# Altium schematic sheet dAir-usb-plug-in-compatible.SchDoc
size A3
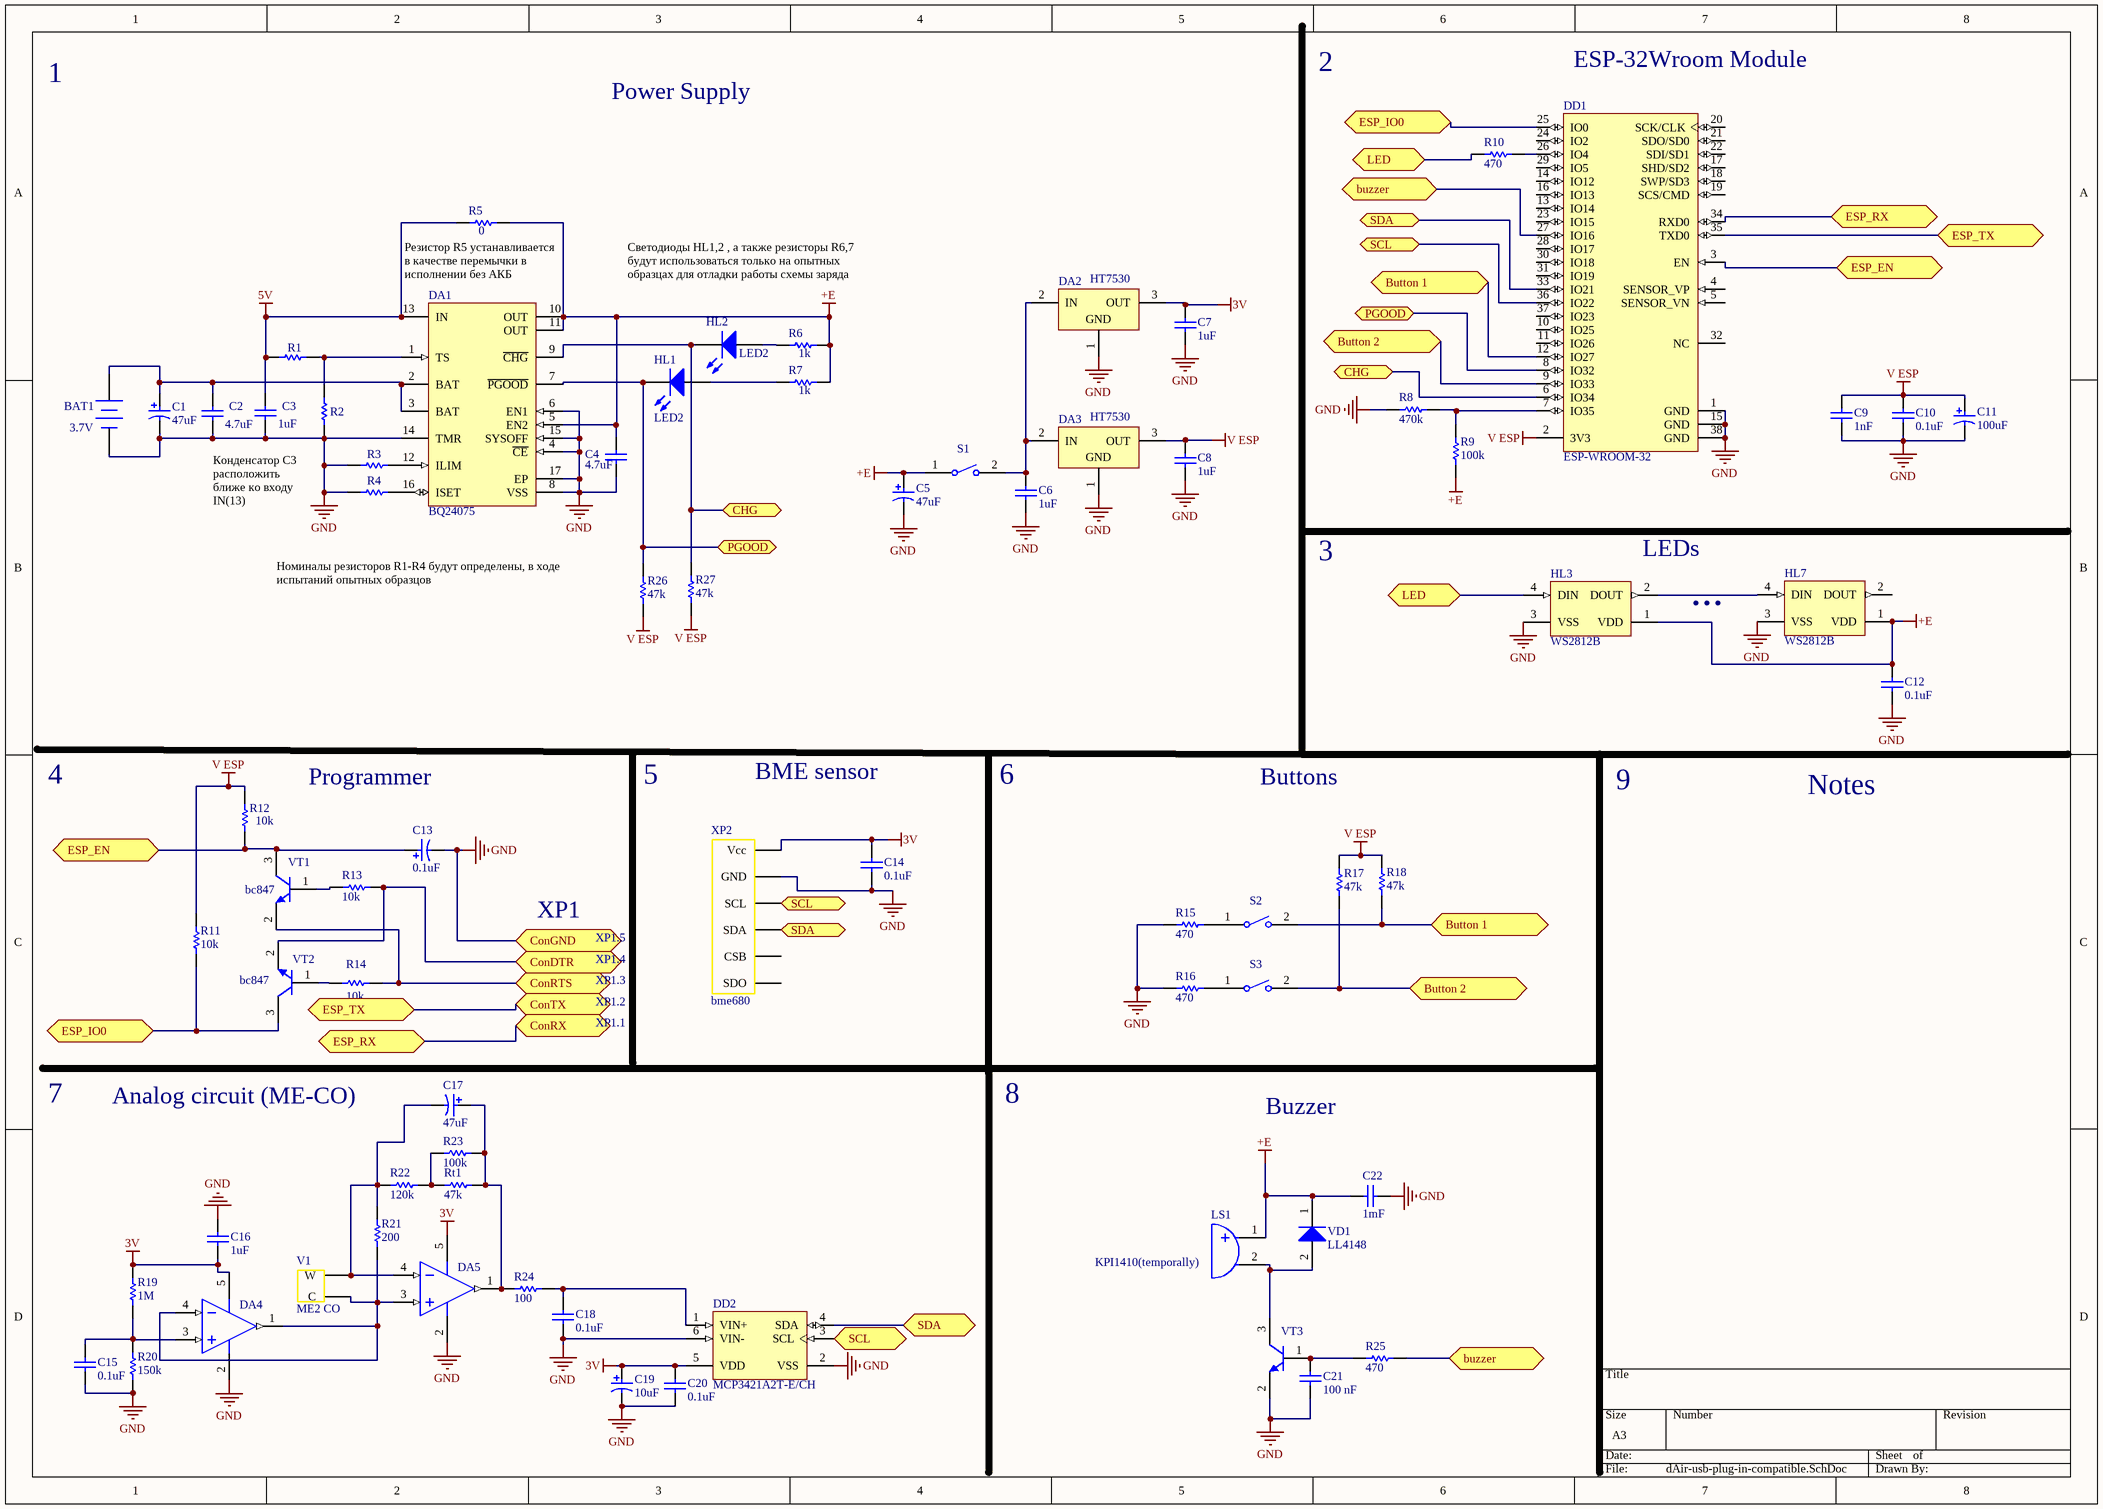
[diagram p0: dAir-usb-plug-in-compatible.SchDoc]

## Parts
BAT1  3.7V  [PANA-CR-2032HFN]
C1  47uF  [KEMT-A-3216-18-2_M]
C2  4.7uF  [CAPC0805(2012)155_L]
C3  1uF  [CAPC0805(2012)155_L]
C4  4.7uF  [CAPC0805(2012)155_L]
C5  47uF  [KEMT-A-3216-18-2_M]
C6  1uF  [CAPC0805(2012)155_L]
C7  1uF  [CAPC0805(2012)155_L]
C8  1uF  [CAPC0805(2012)155_L]
C9  1nF  [CAPC0805(2012)155_L]
C10  0.1uF  [CAPC0805(2012)155_L]
C11  100uF  [KEMT-A-3216-18-2_M]
C12  0.1uF  [CAPC0805(2012)155_L]
C13  0.1uF  [KEMT-A-3216-18-2_M]
C14  0.1uF  [CAPC0805(2012)155_L]
C15  0.1uF  [CAPC0805(2012)155_L]
C16  1uF  [CAPC0805(2012)155_L]
C17  47uF  [KEMT-A-3216-18-2_M]
C18  0.1uF  [CAPC0805(2012)155_L]
C19  10uF  [KEMT-A-3216-18-2_M]
C20  0.1uF  [CAPC0805(2012)155_L]
C21  100 nF  [CAPC0805(2012)155_L]
C22  1mF  [CAPC0805(2012)155_L]
DA1  BQ24075  [RGT0016C_V]
DA2  HT7530  [SOT89_N]
DA3  HT7530  [SOT89_N]
DA4  AD8603AUJ-REEL  [ADI-UJ-5_M]  (value not drawn)
DA5  AD8603AUJ-REEL  [ADI-UJ-5_M]  (value not drawn)
DD1  ESP-WROOM-32  [OLMX-ESP-WROOM-32]
DD2  MCP3421A2T-E/CH  [SOT-23-CH6_L]
HL1  LED2  [3.2X1.6X1.1]
HL2  LED2  [3.2X1.6X1.1]
HL3  WS2812B  [ADAI-WS2812B_V]
HL7  WS2812B  [ADAI-WS2812B_V]
LS1  KPI1410(temporally)  [CZCY-CY-12085G-5042-2_V]
R1  1k  [RESC0805(2012)_M]  (value not drawn)
R2  1k  [RESC0805(2012)_M]  (value not drawn)
R3  1k  [RESC0805(2012)_M]  (value not drawn)
R4  1k  [RESC0805(2012)_M]  (value not drawn)
R5  0  [RESC0805(2012)_M]
R6  1k  [RESC0805(2012)_M]
R7  1k  [RESC0805(2012)_M]
R8  470k  [RESC0805(2012)_M]
R9  100k  [RESC0805(2012)_M]
R10  470  [RESC0805(2012)_M]
R11  10k  [RESC0805(2012)_M]
R12  10k  [RESC0805(2012)_M]
R13  10k  [RESC0805(2012)_M]
R14  10k  [RESC0805(2012)_M]
R15  470  [RESC0805(2012)_M]
R16  470  [RESC0805(2012)_M]
R17  47k  [RESC0805(2012)_M]
R18  47k  [RESC0805(2012)_M]
R19  1M  [RESC0805(2012)_M]
R20  150k  [RESC0805(2012)_M]
R21  200  [RESC0805(2012)_M]
R22  120k  [RESC0805(2012)_M]
R23  100k  [RESC0805(2012)_M]
R24  100  [RESC0805(2012)_M]
R25  470  [RESC0805(2012)_M]
R26  47k  [RESC0805(2012)_M]
R27  47k  [RESC0805(2012)_M]
Rt1  47k  [RESC0805(2012)_M]
S1  FSMSMTR  [TECO-FSMSMTR_V]  (value not drawn)
S2  FSMSMTR  [TECO-FSMSMTR_V]  (value not drawn)
S3  FSMSMTR  [TECO-FSMSMTR_V]  (value not drawn)
V1  ME2 CO  [ME2 CO]
VD1  LL4148  [INF-SOD323_V]
VT1  bc847  [ONSC-SOT-23-3-318-08_V]
VT2  bc847  [ONSC-SOT-23-3-318-08_V]
VT3  (no value)  [ONSC-SOT-23-3-318-08_V]
XP2  bme680  [BME280]

## Ports
Button 1 (bidir), Button 2 (bidir), buzzer (bidir), CHG (bidir), ConDTR (bidir), ConGND (bidir), ConRTS (bidir), ConRX (bidir), ConTX (bidir), ESP_EN (bidir), ESP_IO0 (bidir), ESP_RX (bidir), ESP_TX (bidir), LED (bidir), PGOOD (bidir), SCL (bidir), SDA, SDA (bidir)

## Nets
3V: C7.2 C14.2 C16.1 C19.1 C20.2 DA2.3(OUT) DA4.5(+V) DA5.5(+V) DD2.5(VDD) R19.2 XP2.1(Vcc)
5V: C3.1 DA1.13(IN) R1.1 R5.2
+E: C4.1 C5.1 C12.2 C22.1 DA1.5(EN2) DA1.10(OUT) DA1.11(OUT) HL3.1(VDD) HL7.1(VDD) LS1.1(A) R5.1 R6.1 R7.1 R9.2 S1.1 VD1.1(K)
GND: BAT1.2(-) C1.2 C2.2 C3.2 C4.2 C5.2 C6.1 C7.1 C8.1 C9.1 C10.1 C11.2 C12.1 C13.2 C14.1 C15.1 C16.2 C18.2 C19.2 C20.1 C21.2 C22.2 DA1.4(~{CE}) DA1.6(EN1) DA1.8(VSS) DA1.14(TMR) DA1.15(SYSOFF) DA1.17(EP) DA2.1(GND) DA3.1(GND) DA4.2(-V) DA5.2(-V) DD1.1(GND) DD1.15(GND) DD1.38(GND) DD2.2(VSS) DD2.6(VIN-) HL3.3(VSS) HL7.3(VSS) R2.2 R3.2 R4.2 R8.1 R15.1 R16.1 R20.1 VT3.2(E) XP2.2(GND) ; port ConGND
V ESP: C8.2 C9.2 C10.2 C11.1 DA3.3(OUT) DD1.2(3V3) R11.2 R12.2 R17.2 R18.2 R26.1 R27.1
Button 1: DD1.12(IO27) R18.1 S2.2 ; port Button 1
Button 2: DD1.9(IO33) R17.1 S3.2 ; port Button 2
buzzer: DD1.27(IO16) R25.2 ; port buzzer
CHG: DA1.9(~{CHG}) DD1.6(IO34) HL2.2(K) R27.2 ; port CHG
ConDTR: R13.2 VT2.2(E) ; port ConDTR
ConRTS: R14.2 VT1.2(E) ; port ConRTS
ConRX: DD1.34(RXD0) ; port ConRX, port ESP_RX
ConTX: DD1.35(TXD0) ; port ConTX, port ESP_TX
ESP_EN: C13.1 DD1.3(EN) R12.1 VT1.3(C) ; port ESP_EN
ESP_IO0: DD1.25(IO0) R11.1 VT2.3(C) ; port ESP_IO0
LED: HL3.4(DIN) R10.1 ; port LED
PGOOD: DA1.7(~{PGOOD}) DD1.8(IO32) HL1.2(K) R26.2 ; port PGOOD
SCL: DD1.36(IO22) DD2.3(SCL) XP2.3(SCL) ; port SCL
SDA: DD1.33(IO21) DD2.4(SDA) XP2.4(SDA) ; port SDA
NetBAT1_1: BAT1.1(+) C1.1 C2.1 DA1.2(BAT) DA1.3(BAT)
NetC6_2: C6.2 DA2.2(IN) DA3.2(IN) S1.2
NetC15_2: C15.2 DA4.3(+IN) R19.1 R20.2
NetC17_1: C17.1 DA5.1(OUT) R23.2 R24.1 Rt1.2
NetC17_2: C17.2 DA5.4(-IN) R21.2 R22.1 V1.1(W)
NetC18_1: C18.1 DD2.1(VIN+) R24.2
NetC21_1: C21.1 R25.1 VT3.1(B)
NetDA1_1: DA1.1(TS) R1.2 R2.1
NetDA1_12: DA1.12(ILIM) R3.1
NetDA1_16: DA1.16(ISET) R4.1
NetDA4_1: DA4.1(OUT) DA4.4(-IN) DA5.3(+IN) R21.1 V1.2(C)
NetDD1_7: DD1.7(IO35) R8.2 R9.1
NetDD1_26: DD1.26(IO4) R10.2
NetHL1_1: HL1.1(A) R7.2
NetHL2_1: HL2.1(A) R6.2
NetHL3_2: HL3.2(DOUT) HL7.4(DIN)
NetLS1_2: LS1.2(K) VD1.2(A) VT3.3(C)
NetR13_1: R13.1 VT1.1(B)
NetR14_1: R14.1 VT2.1(B)
NetR15_2: R15.2 S2.1
NetR16_2: R16.2 S3.1
NetR22_2: R22.2 R23.1 Rt1.1

Not connected (* = marked no-connect by the designer): DD1 4(SENSOR_VP) 5(SENSOR_VN) 10(IO25) 11(IO26) 13(IO14) 14(IO12) 16(IO13) 17(SHD/SD2) 18(SWP/SD3) 19(SCS/CMD) 20(SCK/CLK) 21(SDO/SD0) 22(SDI/SD1) 23(IO15) 24(IO2) 28(IO17) 29(IO5) 30(IO18) 31(IO19) 32(NC) 37(IO23); HL7 2(DOUT); XP2 5(CSB) 6(SDO)

## Notes on the sheet
- 1
- Power Supply
- 2
- (near DD1) ESP-32Wroom Module
- (near R5) Резистор R5 устанавливается в качестве перемычки в исполнении без АКБ
- Светодиоды HL1,2 , а также резисторы R6,7 будут использоваться только на опытных образцах для отладки работы схемы заряда
- Конденсатор C3 расположить ближе ко входу IN(13)
- 3
- (near HL3) LEDs
- Номиналы резисторов R1-R4 будут определены, в ходе испытаний опытных образцов
- (near HL7) ...
- 4
- Programmer
- 5
- BME sensor
- 6
- Buttons
- 9
- Notes
- XP1
- XP1.3
- XP1.4
- XP1.5
- XP1.1
- XP1.2
- 7
- Analog circuit (ME-CO)
- 8
- Buzzer

## Library data of the parts
BAT1 = CMP-2000-05296-1: Coin Cell Battery, 225 mAh, 0.2 mA, 3 V, -30 to 60 degC, Bulk; Manufacturer: Panasonic; SVHC: 1,2-dimethoxyethane,ethyleneglycoldimethylether(EGDME)(15-Jun-2015); Battery Size Code: 2032; Battery Voltage: 3V; Battery IEC Code: CR2032; Battery NEDA Code: 5004LC; External Height: 3.2mm; Battery Terminals: PCBPins; Battery Capacity: 220mAh; External Diameter: 20mm; Battery Technology: LithiumManganeseDioxide; Product Range: -; Datasheet Version: Rev. 0, 05/2010; Manufacturer URL: http://www.panasonic.com/; External Depth: -; Weight: 2.9g; Datasheet URL: https://datasheet.ciiva.com/3/aaa4000de87-3072.pdf; External Width: -
C1 C5 C11 C13 C17 C19 = CMP-2000-05172-1: Manufacturer Size Code: A; Manufacturer: Kemet; Type: Molded; Online Catalog: T491Series; Other Names: 399-3684-2; Voltage - Rated: 10V; Lifetime @ Temp.: 2000Hrs@85degC; Product Training Modules: CapacitorBasics-TypicalUsesforCapacitorsDeratingGuidelinesforSurfaceMountTantalumCapacitors; ESR (Equivalent Series Resistance): 3.8Ohm; Tolerance: ±10%; Capacitance: 10µF; Catalog Drawings: T49x,T5xxSeries_A-side1T49x,T5xxSeries_A,B-side2T49x,T5xxSeries_A,SBottom; Family: TantalumCapacitors; Manufacturer URL: http://www.kemet.com/; Datasheet URL: http://www.farnell.com/datasheets/1824869.pdf; Package Reference: 1206; Packaging: Tape&Reel(TR); Series: T491; Operating Temperature: -55degC~125degC; Mounting Type: SurfaceMount; Height - Seated (Max): 0.071"(1.80mm); Package / Case: 1206(3216Metric); Package Description: 2-Pin Surface Mount Device, Body 3.2 x 1.6 mm; Features: GeneralPurpose; Lead Spacing: -; Size / Dimension: 0.126"Lx0.063"W(3.20mmx1.60mm); Standard Package: 2,000; Datasheet Version: Apr-14; Category: Capacitors
C2-C4 C6-C10 C12 C14-C16 C18 C20 = CMP-1036-04882-1: CAP 4.7uF 10V ±10% 0805 (2012 Metric) Thickness 1.55mm SMD; Case-EIA: 0805; Tolerance: Â±10%; Case-Metric: 2012; Rated Voltage: 10 V; Max Thickness: 1.55 mm; Technology: SMT; Value: 4.7uF
C21 C22 = CMP-1036-04882-1: CAP 4.7uF 10V ±10% 0805 (2012  Thickness 1.55mm SMD; Case-EIA: 0805; Tolerance: Â±10%; Case-Metric: 2012; Rated Voltage: 10 V; Max Thickness: 1.55 mm; Technology: SMT; Value: 4.7uF
DA1 = CMP-0321-00238-2: USB-Friendly Li-Ion Battery Charger and Power-Path Management IC, Vout 5.5 V, 4.3 V, -40 to 85 degC, 16-pin QFN (RGT), Green (RoHS & no Sb/Br); PartNumber: BQ24075RGTR; Manufacturer: Texas Instruments; SubFamily: Battery Charge Management; NiCd: N; Vin(Min)(V): 4.3; Mounting Technology: Surface Mount; PackageDescription: 16-Pin Plastic Quad Flat No-Lead, 3 x 3 mm Body, 0.5 mm Pitch, 1.7 x 1.7 mm Exposed Pad; Over Voltage Protection: N; Code_JEDEC: MO-220; Li-Ion: N; Eco-Plan: Green (RoHS & no Sb/Br); DatasheetVersion: SLUS810G; PackageVersion: revH, Oct-2011; PackageReference: RGT0016C; ComponentLink1URL: http://www.ti.com/general/docs/lit/getliterature.tsp?genericPartNumber=BQ24075&fileType=pdf; Lead Acid: N; ComponentLink1Description: Datasheet; Li-Polymer: N; NiMH: N
DA2 DA3 = CMP-0204-00106-1: 100mA Low Power LDO, Output Voltage 3.0V, SOT89 Pkg; DatasheetVersion: Rev1.80, Mar-2010; PackageDescription: 3-Pin SOT-89 Package 1.5 mm Pitch, 4.1 mm Lead Span; PackageReference: SOT89; PackageVersion: May-2010; Code_IPC: SOT89
DA4 DA5 = CMP-0384-02070-2: Single Channel Single-Supply Operation Operational Amplifier, 400 KHz BW, 100 mV/us SR, Industrial, 5-pin SOT23 (UJ-5), Reel; Manufacturer: Analog Devices; Generic Part Number: AD8603; Iq/Amp: 50uA; Input Bias Current: 200fA; V Span Min: 1.8V; Small Signal Bandwidth: 400KHz; Input Offset Voltage: 12uV; V Span Max: 6V; Amplifiers Per Package: 1; ComponentLink2Description: Datasheet; RevisionNote: Reference Circuit URL fixed; ComponentLink3URL: http:/www.analog.com/static/imported-files/packages/PKG_PDF/TSOT(UJ)/UJ_5.pdf; ComponentLink1URL: http://www.analog.com/en/index.html; Mounting Technology: Surface Mount; ComponentLink1Description: Manufacturer URL; PackageReference: UJ-5; ComponentLink4Description: Reference Circuit; DatasheetVersion: Rev. C; ComponentLink3Description: Package Specification; PartNumber: AD8603AUJ-REEL; PackageVersion: 100708-A; ComponentLink2URL: http://www.analog.com/static/imported-files/data_sheets/AD8603_8607_8609.pdf; PackageDescription: 5-Pin Thin Small Outline Transistor Package, Body 2.9 x 1.6 mm, Pitch 0.95 mm; ComponentLink4URL: http://www.analog.com/en/all-operational-amplifiers-op-amps/operational-amplifiers-op-amps/ad8603/products/product.html#product-recommendations; Code_JEDEC: MO-193-AB; Slew Rate: 100mV/us
DD1 = CMP-2000-07454-1: Espressif System, 2.7 to 3.6 V, -40 to 85 degC, 38-Pin SMD; Manufacturer: Olimex; Package Description: 38-Pin Surface Mount Device, Body 18 x 25.5 mm, Pitch 1.27 mm; Manufacturer URL: https://www.olimex.com; RoHSCompliant: false; Mounting Technology: SurfaceMount; Datasheet Version: Rev. 2.1, 09/2017; Datasheet URL: http://www.espressif.com/sites/default/files/documentation/esp-wroom-32_datasheet_en.pdf; Package Reference: ESP-WROOM-32
DD2 = CMP-0188-00097-2: 18-Bit Analog-to-Digital Converter with I2C Interface and On-Board Reference, 6-Pin SOT-23, Extended Temperature, Tape and Reel; ComponentLink3URL: http://www.microchip.com/stellent/groups/techpub_sg/documents/packagingspec/en012702.pdf; DatasheetVersion: revE, Aug-2009; Code_IPC: SOT26A-6; RevisionNote: URLs added.; ComponentLink2URL: http://ww1.microchip.com/downloads/en/DeviceDoc/22003e.pdf; ComponentLink1URL: http://www.microchip.com/; ComponentLink3Description: Package Specification; ComponentLink2Description: Datasheet; PackageReference: SOT-23-CH6; PackageDescription: 6-Lead Plastic Small Outline Transistor (CH) [SOT-23]; PackageVersion: revBB, Aug-2009; ComponentLink1Description: Manufacturer URL
HL1 HL2 = LED2: Typical RED, GREEN, YELLOW, AMBER GaAs LED; Published: 8-Jun-2000; LatestRevisionDate: 17-Jul-2002; LatestRevisionNote: Re-released for DXP Platform.; PackageVersion: Feb-2002; PackageReference: 3.2X1.6X1.1; Publisher: Altium Limited; PackageDescription: SM LED; 2 Flat Leads
HL3 HL7 = CMP-1740-00005-1: Intelligent Control LED Integrated Light Source, 3.5 to 5.3 V, -25 to 80 degC, 4-Pin SMD, RoHS, Bulk; Case\Package: Radial; Shielding: Unshielded; Current Rating: 240 mA; Tolerance: 10%; Mount: Through Hole; Max Operating Temperature: 125 degC; Radiation Hardening: No; Length: 12.2 mm; Min Operating Temperature: -55 degC; ComponentLink1URL: https://www.adafruit.com/; Packaging: Bulk; Lead Pitch: 5 mm; RoHSCompliant: true; Pins: 2; Package Quantity: 200; ComponentLink2URL: https://cdn-shop.adafruit.com/datasheets/WS2812B.pdf; ComponentLink2Description: Datasheet; PackageDescription: 4-Pin Surface Mount Device, Body 5 x 5 mm, Pitch 3.3 mm; PackageReference: WS2812B; Height: 12.2 mm; REACH SVHC: No SVHC; ComponentLink1Description: Manufacturer URL; DatasheetVersion: May-13
LS1 = CMP-1019-00001-1: Buzzer, 5 V, 42 Ohm, -20 to 70 degC, 2-Pin THD, Dia 12 mm, Height 8.5 mm, RoHS, Tray; PartNumber: cy-12085G-5042; Manufacturer: Changzhou Chaoyin; Oscillation Frequency: 2.048 KHz; Rated Voltage: 5 V; Current Consumption (Max.): 35 mA; Resistance Value: 42 +/- 4 Ohm; Sound Pressure Level (Min.): 85 dB; PackageReference: CY-12085G-5042; Mounting Technology: Through Hole; Packing: Tray; RoHS: TRUE; Operating Temperature Range: -20 to 70 degC; PackageDescription: 2-Pin Through-hole Buzzer, Dia 12 mm, Height 8.5 mm
R1-R27 Rt1 = CMP-1013-00017-1: Value: 4.30 Ohm; Tolerance: 5 %; Power: 0.125 W; Case-Metric: 2012; Case-EIA: 0805; Technology: SMT
S1-S3 = CMP-2000-07501-1: FSMSM Push Button Switch, 50 mA, -35 to 85 degC, 2-Pin SMD, RoHS, Tape and Reel; Manufacturer: TE Connectivity; Voltage Rating (DC): 24V; Electrical Life: 20000Cycles; Operating Force: 180gf; Switch Travel: 0.25mm; Contact Current Rating: 50mA; Case\/Package: SMD/SMT; Actuator Length: 1.07mm; Throw Configuration: SPST; Actuator Material: Polyamide; Contact Resistance: 100mOhm; Illumination Type: Illuminated; Max Voltage Rating (DC): 12V; Manufacturer URL: http://www.te.com/; Lead Free: LeadFree; Packaging: TapeandReel; Min Operating Temperature: -35degC; Mechanical Life: 20000Cycles; Mount: SurfaceMount; REACH SVHC: Unknown; Package Quantity: 1800; Package Reference: FSMSMTR; RoHSCompliant: true; Max Operating Temperature: 85degC; Orientation: Straight; ELV: Compliant; Datasheet URL: http://www.te.com/commerce/DocumentDelivery/DDEController?Action=showdoc&DocId=Customer+Drawing%7F1437566-3%7FC2%7Fpdf%7FEnglish%7FENG_CD_1437566-3_C2_1437566_3_1_c.dwg.pdf%7F1437566-4; Package Description: 2-Pin Surface Mount Device, Body 6 x 3.5 mm, Pitch 9.19 mm; Current Rating: 50mA; Contact Plating: Silver; Termination: GullWing; Datasheet Version: Rev. C2, 08/2014; Contact Material: Brass; Mounting Technology: SurfaceMount
VD1 = CMP-1182-00006-1: Silicon Schottky Diode, SOD323, Reel, Green; Manufacturer: Infineon; PartNumber: BAT 54-03W E6327; Green: TRUE; ComponentLink1Description: Manufacturer URL; ComponentLink1URL: http://www.infineon.com/; PackageReference: SOD323; Packing: Reel; PackageDescription: 2-Pin Small Outline Diode Package, 1.25 x 1.7 mm Body; ComponentLink2Description: Datasheet; Mounting Technology: Surface Mount; ComponentLink3URL: http://www.infineon.com/dgdl/SOD323-Package_Overview.pdf?folderId=db3a30431936bc4b011952aab84f3bbe&fileId=db3a30431936bc4b011952beed653be3; ComponentLink3Description: Package Specification; ComponentLink2URL: http://www.infineon.com/dgdl/bat54series.pdf?folderId=db3a30431400ef68011425f1ca2505e3&fileId=db3a304314dca3890115190b74210ea6; RevisionNote: Lost Devices pt2
VT1-VT3 = CMP-1048-00737-1: General Purpose Transistor, NPN Silicon, 3-Pin SOT-23, Pb-Free, Tape and Reel; Manufacturer: On Semiconductor; PartNumber: BC817-25LT1G; IC Continuous (A): 0.5; fT Min (MHz): 100; PackageDescription: 3-Pin Small Outline Transistor, Body 2.92 x 1.3 mm, Pitch 0.95 mm; ComponentLink3Description: Package Specification; ComponentLink2Description: Datasheet; RoHS: TRUE; PackageVersion: Rev. AP, 11/2009; ComponentLink1URL: http://www.onsemi.com/; PackageReference: SOT-23-3-318-08; ComponentLink3URL: http://www.onsemi.cn/pub_link/Collateral/318-08.PDF; ComponentLink2URL: http://www.onsemi.com/pub_link/Collateral/BC817-16LT1-D.PDF; Mounting Technology: Surface Mount; Packing: Tape and Reel; DatasheetVersion: Rev. 12; Polarity: NPN; ComponentLink1Description: Manufacturer URL
XP2 = bme280